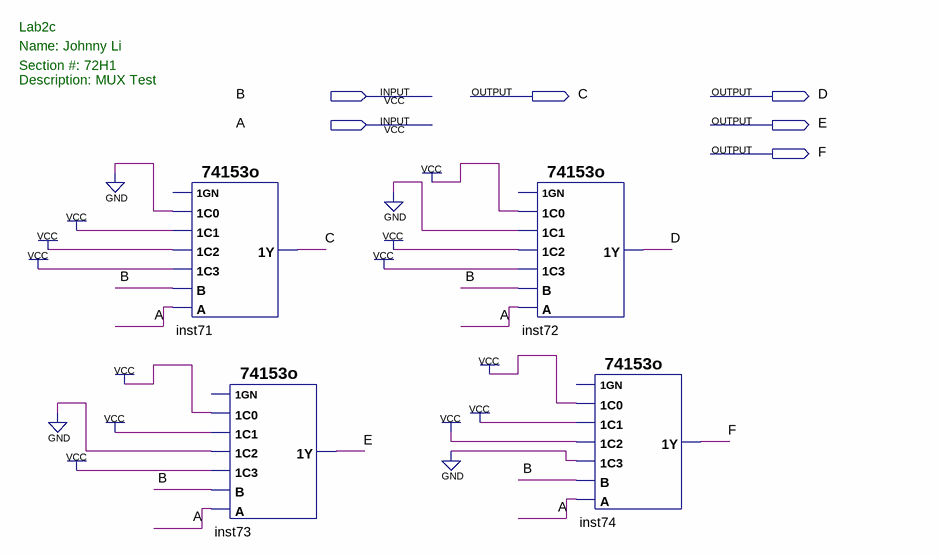
[diagram p0: schematic sheet]
// Quartus schematic lab2_MUX_TEST.bdf as structural Verilog: 4 symbols, 6 pins
module lab2_MUX_TEST (
  input  B,
  input  A,
  output C,
  output D,
  output E,
  output F
);

  \74153o  inst71 (.\1C3 (1'b1), .\1C1 (1'b1), .\1C0 (1'b0), .\1C2 (1'b1), .A(A), .B(B), .\1Y (C));  // open: 1GN
  \74153o  inst73 (.\1C3 (1'b1), .\1C1 (1'b1), .\1C0 (1'b1), .\1C2 (1'b0), .A(A), .B(B), .\1Y (E));  // open: 1GN
  \74153o  inst72 (.\1C3 (1'b1), .\1C1 (1'b0), .\1C0 (1'b1), .\1C2 (1'b1), .A(A), .B(B), .\1Y (D));  // open: 1GN
  \74153o  inst74 (.\1C3 (1'b0), .\1C1 (1'b1), .\1C0 (1'b1), .\1C2 (1'b1), .A(A), .B(B), .\1Y (F));  // open: 1GN

  // Notes on the sheet:
  //   Lab2c
  //   Name: Johnny Li
  //   Section #: 72H1
  //   Description: MUX Test
endmodule
